# EAGLE schematic scrump (EAGLE 7.7.0)
CNAME: Tschrump Weather Station; DESIGNER: Emre Elmas

## Sheet 1 of 2: uC
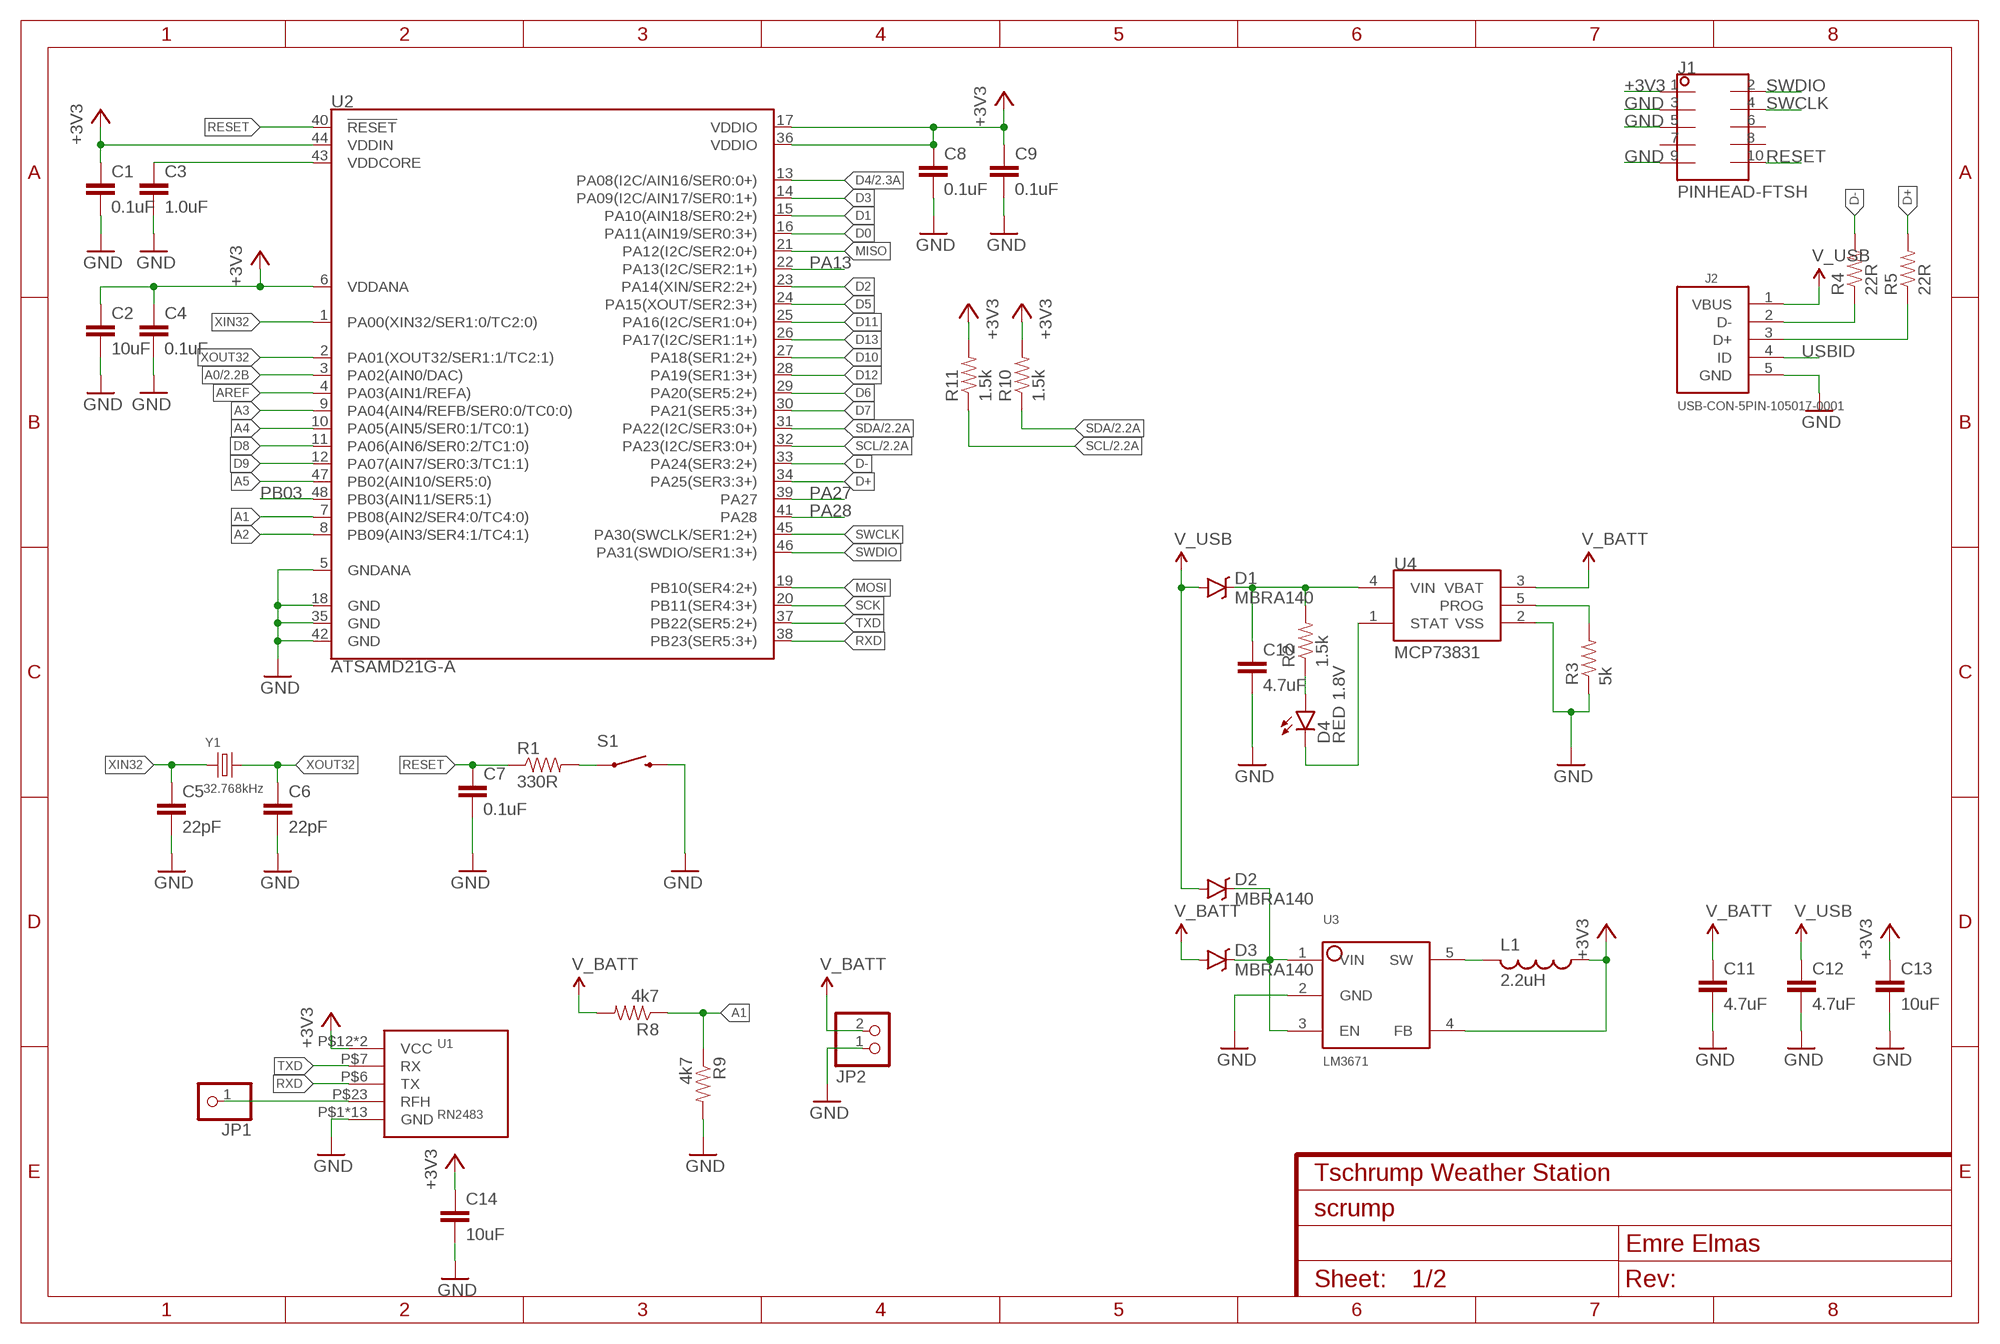
[diagram p0: schematic, sheet 1]

### Parts
C1  0.1uF  CAP0603-CAP  [0603-CAP]
C2  10uF  CAP0603-CAP  [0603-CAP]
C3  1.0uF  CAP0603-CAP  [0603-CAP]
C4  0.1uF  CAP0603-CAP  [0603-CAP]
C5  22pF  CAP0603-CAP  [0603-CAP]
C6  22pF  CAP0603-CAP  [0603-CAP]
C7  0.1uF  0.1UF-25V(+80/-20%)(0603)  [0603-CAP]
C8  0.1uF  CAP0603-CAP  [0603-CAP]
C9  0.1uF  CAP0603-CAP  [0603-CAP]
C10  4.7uF  CAP0603-CAP  [0603-CAP]
C11  4.7uF  CAP0603-CAP  [0603-CAP]
C12  4.7uF  CAP0603-CAP  [0603-CAP]
C13  10uF  CAP0603-CAP  [0603-CAP]
C14  10uF  CAP0603-CAP  [0603-CAP]
D1  MBRA140  [SMA-DIODE]
D2  MBRA140  [SMA-DIODE]
D3  MBRA140  [SMA-DIODE]
D4  RED 1.8V  LED-RED0603  [LED-0603]
J1  PINHEAD-FTSH  [FTSH-105-01-XXX-DV-K]
J2  USB-CON-5PIN-105017-0001  [USB-MICRO-MOLEX-105017-0001]
JP1  PINHD-1X1  [1X01]
JP2  PINHD-1X2  [1X02]
L1  2.2uH  INDUCTOR  [0806-INDUCTOR]
R1  330R  RESISTOR0603  [0603-RES]
R2  1.5k  RESISTOR0603  [0603-RES]
R3  5k  RESISTOR0603  [0603-RES]
R4  22R  RESISTOR0603  [0603-RES]
R5  22R  RESISTOR0603  [0603-RES]
R8  4k7  RESISTOR0603  [0603-RES]
R9  4k7  RESISTOR0603  [0603-RES]
R10  1.5k  RESISTOR0603  [0603-RES]
R11  1.5k  RESISTOR0603  [0603-RES]
S1  PUSHBUTTON-SMD  [TACTILE-SMD-SWITCH]
U1  RN2483  [RN2483]
U2  ATSAMD21G-A  [TQFP-48]
U3  LM3671  [SOT23-5]
U4  MCP73831  [SOT23-5]
Y1  32.768kHz  CRYSTAL  [ABS25]

### Nets
+3V3: C1.1 C2.1 C4.1 C8.1 C9.1 C13.1 C14.1 J1.1 L1.1 R10.2 R11.2 U1.P$12(VCC) U1.P$34(VCC) U2.6(VDDANA) U2.17(VDDIO) U2.36(VDDIO) U2.44(VDDIN) U3.4(FB) ; also sheet 2
A0: U2.3(PA02(AIN0/DAC)) ; also sheet 2
A1: R8.1 R9.1 U2.7(PB08(AIN2/SER4:0/TC4:0))
A2: U2.8(PB09(AIN3/SER4:1/TC4:1))
A3: U2.9(PA04(AIN4/REFB/SER0:0/TC0:0))
A4: U2.10(PA05(AIN5/SER0:1/TC0:1))
A5: U2.47(PB02(AIN10/SER5:0))
AREF: U2.4(PA03(AIN1/REFA))
D0: U2.16(PA11(AIN19/SER0:3+))
D1: U2.15(PA10(AIN18/SER0:2+))
D2: U2.23(PA14(XIN/SER2:2+))
D3: U2.14(PA09(I2C/AIN17/SER0:1+))
D4: U2.13(PA08(I2C/AIN16/SER0:0+)) ; also sheet 2
D5: U2.24(PA15(XOUT/SER2:3+))
D6: U2.29(PA20(SER5:2+))
D7: U2.30(PA21(SER5:3+))
D8: U2.11(PA06(AIN6/SER0:2/TC1:0))
D9: U2.12(PA07(AIN7/SER0:3/TC1:1))
D10: U2.27(PA18(SER1:2+))
D11: U2.25(PA16(I2C/SER1:0+))
D12: U2.28(PA19(SER1:3+))
D13: U2.26(PA17(I2C/SER1:1+))
D+: R5.2 U2.34(PA25(SER3:3+))
D-: R4.2 U2.33(PA24(SER3:2+))
GND: C1.2 C2.2 C3.2 C4.2 C5.2 C6.2 C7.2 C8.2 C9.2 C10.2 C11.2 C12.2 C13.2 C14.2 J1.3 J1.5 J1.9 J2.5(GND) JP2.1 R3.1 R9.2 S1.P$3 S1.P$4 U1.P$1(GND) U1.P$8(GND) U1.P$11(GND) U1.P$20(GND) U1.P$21(GND) U1.P$22(GND) U1.P$24(GND) U1.P$26(GND) U1.P$27(GND) U1.P$28(GND) U1.P$33(GND) U1.P$41(GND) U1.P$47(GND) U2.5(GNDANA) U2.18(GND) U2.35(GND) U2.42(GND) U3.2(GND) U4.2(VSS) ; also sheet 2
MISO: U2.21(PA12(I2C/SER2:0+))
MOSI: U2.19(PB10(SER4:2+))
N$1: C3.1 U2.43(VDDCORE)
N$2: R1.2 S1.P$1 S1.P$2
N$3: C10.1 D1.C R2.2 U4.4(VIN)
N$4: J2.3(D+) R5.1
N$5: L1.2 U3.5(SW)
N$6: D4.C U4.1(STAT)
N$7: D4.A R2.1
N$8: R3.2 U4.5(PROG)
N$9: J2.2(D-) R4.1
N$10: D2.C D3.C U3.1(VIN) U3.3(EN)
N$11: JP1.1 U1.P$23(RFH)
PA13: U2.22(PA13(I2C/SER2:1+))
PA27: U2.39(PA27)
PA28: U2.41(PA28)
PB03: U2.48(PB03(AIN11/SER5:1))
RESET: C7.1 J1.10 R1.1 U2.40(!RESET!)
RXD: U1.P$6(TX) U2.38(PB23(SER5:3+))
SCK: U2.20(PB11(SER4:3+))
SCL: R11.1 U2.32(PA23(I2C/SER3:0+)) ; also sheet 2
SDA: R10.1 U2.31(PA22(I2C/SER3:0+)) ; also sheet 2
SWCLK: J1.4 U2.45(PA30(SWCLK/SER1:2+))
SWDIO: J1.2 U2.46(PA31(SWDIO/SER1:3+))
TXD: U1.P$7(RX) U2.37(PB22(SER5:2+))
USBID: J2.4(ID)
V_BATT: C11.1 D3.A JP2.2 R8.2 U4.3(VBAT)
V_USB: C12.1 D1.A D2.A J2.1(VBUS)
XIN32: C5.1 U2.1(PA00(XIN32/SER1:0/TC2:0)) Y1.P$1
XOUT32: C6.1 U2.2(PA01(XOUT32/SER1:1/TC2:1)) Y1.P$4
Unconnected: J1.6 J1.7 J1.8

## Sheet 2 of 2: Sensors
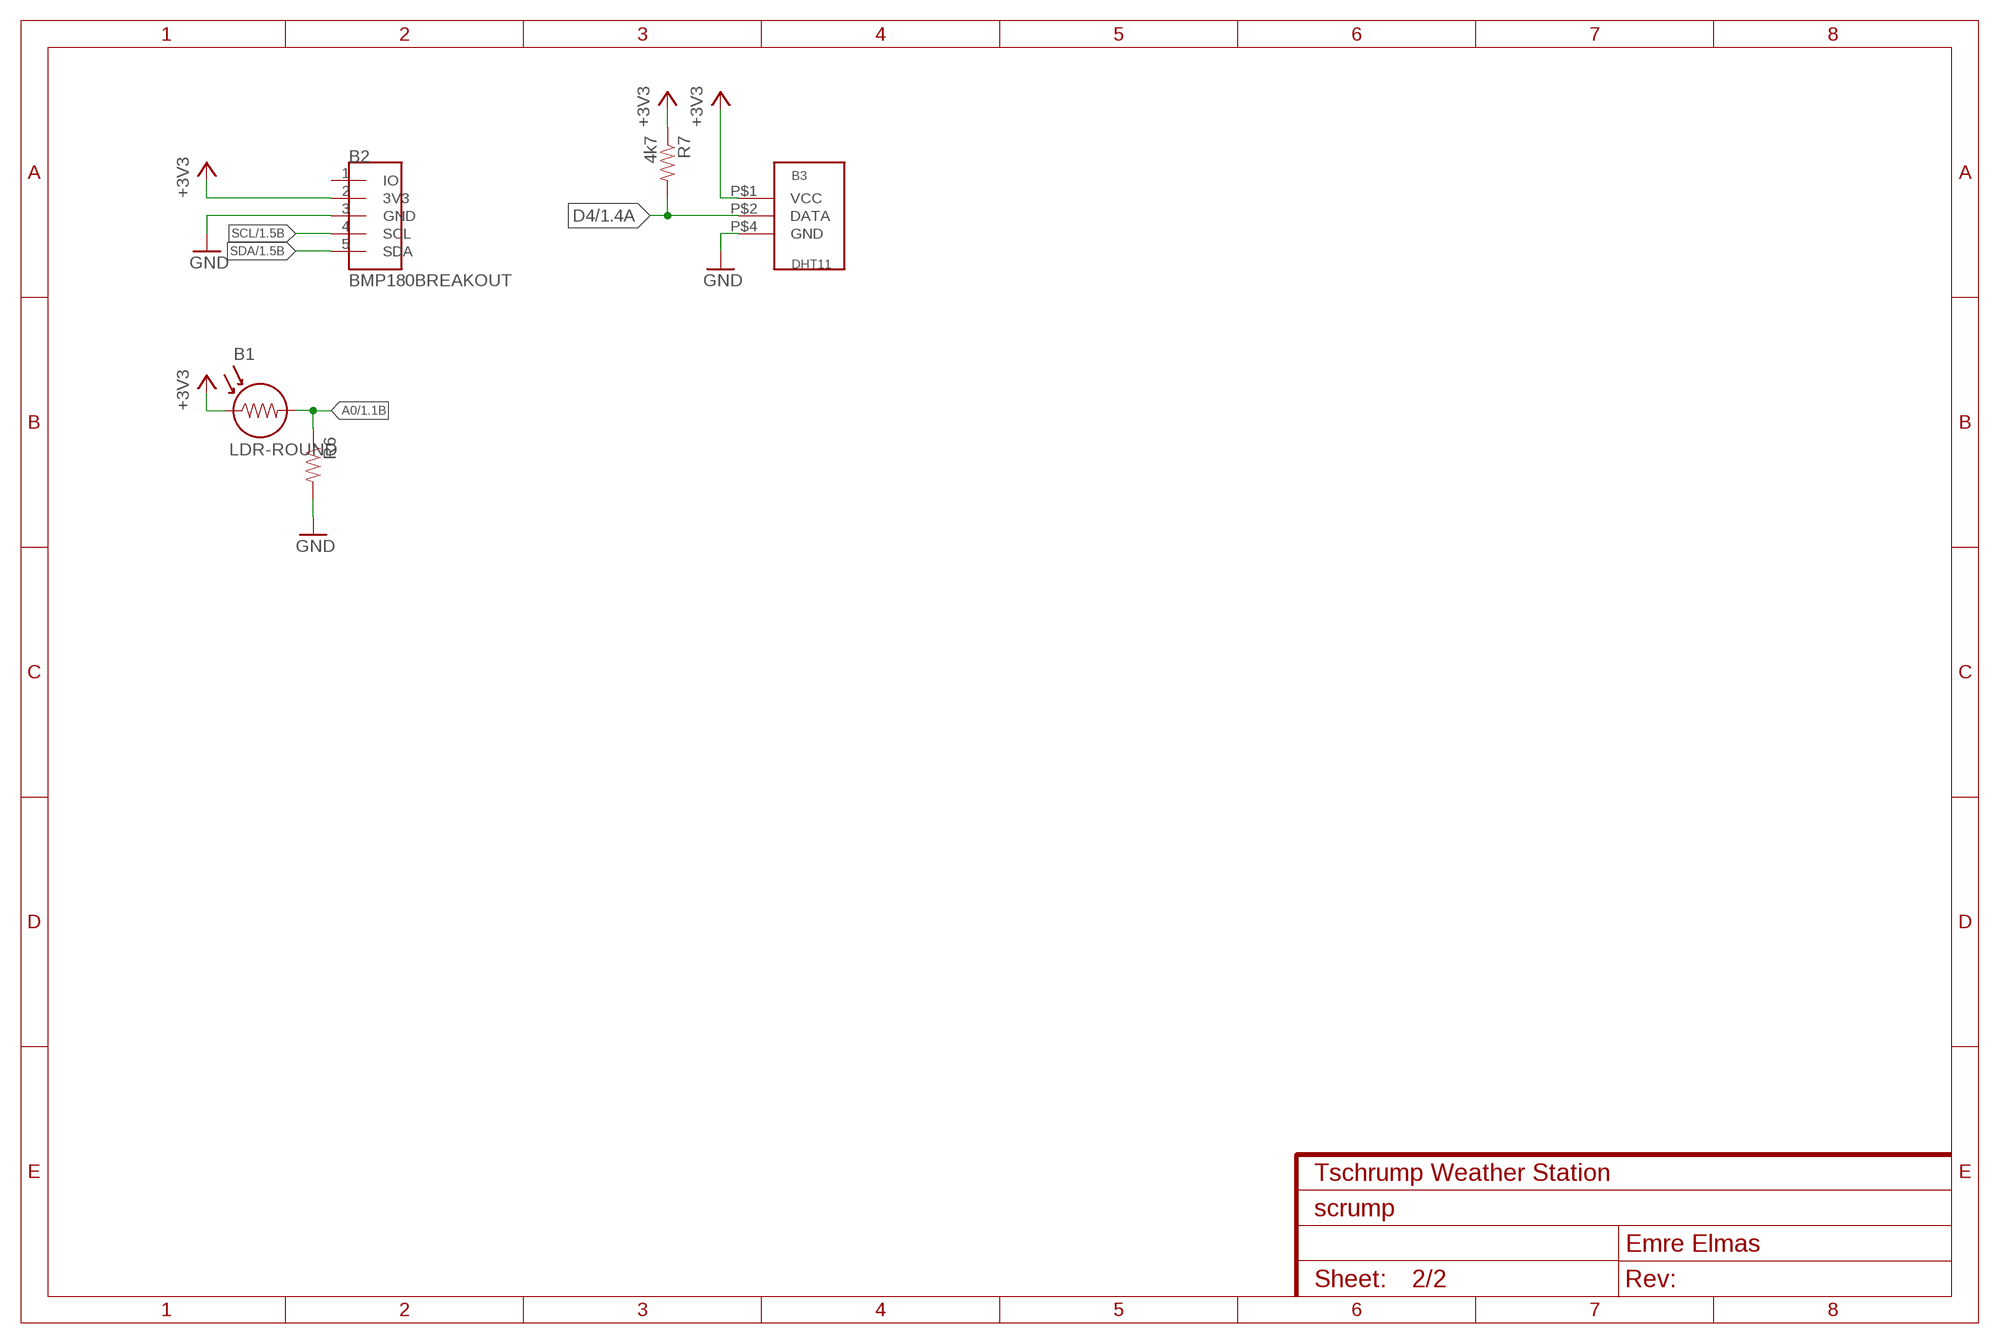
[diagram p1: schematic, sheet 2]

### Parts
B1  LDR-ROUND  [LDR-ROUND]
B2  BMP180BREAKOUT  [BMP180_BREAKOUT]
B3  DHT11  [DHT11]
R6  RESISTOR0603  [0603-RES]
R7  4k7  RESISTOR0603  [0603-RES]

### Nets
+3V3: B1.P$1 B2.2(3V3) B3.P$1(VCC) R7.1 ; also sheet 1
A0: B1.P$2 R6.1 ; also sheet 1
D4: B3.P$2(DATA) R7.2 ; also sheet 1
GND: B2.3(GND) B3.P$4(GND) R6.2 ; also sheet 1
SCL: B2.4(SCL) ; also sheet 1
SDA: B2.5(SDA) ; also sheet 1
Unconnected: B2.1(IO)

## Library data of the parts
B1 = mylibrary:LDR-ROUND
B2 = mylibrary:BMP180
B3 = mylibrary:DHT11
C1-C6 C8-C14 = SparkFun-Capacitors:CAP: Capacitor Standard 0603 ceramic capacitor, and 0.1" leaded capacitor.
C7 = SparkFun-Capacitors:0.1UF-25V(+80/-20%)(0603): CAP-00810 Ceramic Standard decoupling cap; PROD_ID: CAP-00810
D1-D3 = SparkFun-DiscreteSemi:MBRA140: 40V, 1A Schottky rectifier SMA/DO-214AC package DIO-08053; PROD_ID: DIO-08053
D4 = SparkFun-LED:LED-RED: Assorted Red LEDs LilyPad 1206- DIO-09912 1206- DIO-00809 0603- DIO-00819 "SMART" means more efficient and expensive; PROD_ID: DIO-00819; VALUE: RED
J1 = mylibrary:PINHEAD-FTSH
J2 = mylibrary:USB-CON-5PIN: Molex Micro USB 105017-0001
JP1 = pinhead:PINHD-1X1: PIN HEADER
JP2 = pinhead:PINHD-1X2: PIN HEADER
L1 = mylibrary:INDUCTOR
R1-R11 = SparkFun-Resistors:RESISTOR: Resistor Basic schematic elements and footprints for 0603, 1206, and PTH resistors.
S1 = mylibrary:PUSHBUTTON-SMD
U1 = mylibrary:RN2483
U2 = SparkFun-DigitalIC:ATSAMD21G: Atmel SAMD21G SMART ARM-Based Microcontroller The Atmel ® | SMART ™ SAM D21 is a series of low-power microcontrollers using the 32-bit ARM ® Cortex ® -M0+ processor, and ranging from 32- to 64-pins with up to 256KB Flash and 32KB of SRAM. The SAM D21 devices operate at a maximum frequency of 48MHz and reach 2.46 CoreMark/MHz. They are designed for simple and intuitive migration with identical peripheral modules, hex compatible code, identical linear address map and pin compatible migration paths between all devices in the product series. All devices include intelligent and flexible peripherals, Atmel Event System for inter-peripheral signaling, and support for capacitive touch button, slider and wheel user interfaces.; PROD_ID: IC-13064
U3 = mylibrary:LM3671
U4 = mylibrary:MCP73831
Y1 = mylibrary:CRYSTAL